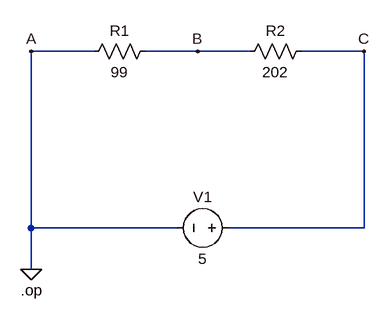
[diagram p0: schematic Divisor de Tensio.asc]
Divisor de Tensio.asc, the LTspice schematic file:
Version 4
SHEET 1 880 680
WIRE 48 80 -48 80
WIRE 208 80 128 80
WIRE 288 80 208 80
WIRE 464 80 368 80
WIRE -48 352 -48 80
WIRE 176 352 -48 352
WIRE 464 352 464 80
WIRE 464 352 256 352
WIRE -48 416 -48 352
FLAG -48 416 0
FLAG -48 80 A
FLAG 208 80 B
FLAG 464 80 C
SYMBOL res 144 64 R90
WINDOW 0 0 56 VBottom 2
WINDOW 3 32 56 VTop 2
SYMATTR InstName R1
SYMATTR Value 99
SYMBOL res 384 64 R90
WINDOW 0 0 56 VBottom 2
WINDOW 3 32 56 VTop 2
SYMATTR InstName R2
SYMATTR Value 202
SYMBOL voltage 272 352 R90
WINDOW 0 -32 56 VBottom 2
WINDOW 3 32 56 VTop 2
WINDOW 123 0 0 Left 0
WINDOW 39 0 0 Left 0
SYMATTR InstName V1
SYMATTR Value 5
TEXT -64 448 Left 2 !.op

The netlist it stands for:
* Divisor de Tensio.asc
R1 B 0 99
R2 C B 202
V1 C 0 5
.op
.backanno
.end